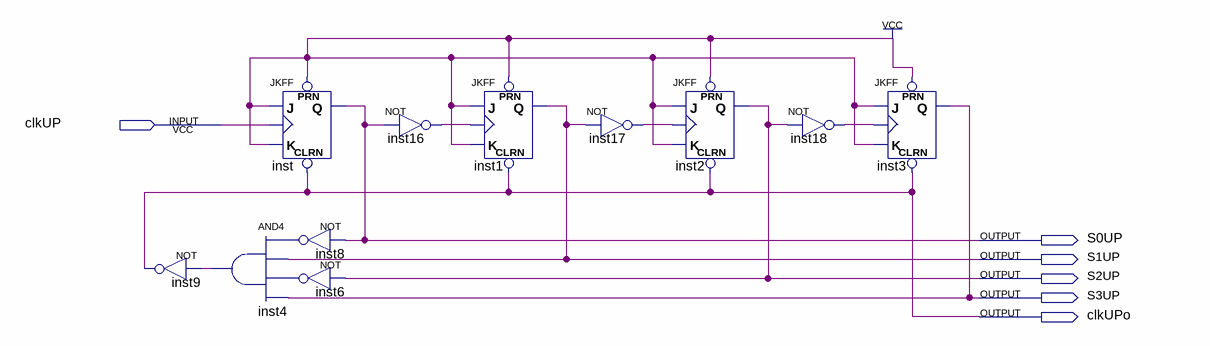
[diagram p0: schematic sheet]
// Quartus schematic contUP.bdf as structural Verilog: 11 symbols, 6 pins
module contUP (
  input  clkUP,
  output S0UP,
  output S1UP,
  output S2UP,
  output S3UP,
  output clkUPo
);

  wire inst4_out, inst6_out, inst8_out, inst16_out, inst17_out, inst18_out;

  not inst9 (clkUPo, inst4_out);
  JKFF inst (.PRN(1'b1), .CLRN(clkUPo), .K(1'b1), .J(1'b1), .CLK(clkUP), .Q(S0UP));
  and inst4 (inst4_out, inst8_out, S1UP, inst6_out, S3UP);
  not inst8 (inst8_out, S0UP);
  not inst6 (inst6_out, S2UP);
  not inst16 (inst16_out, S0UP);
  JKFF inst1 (.PRN(1'b1), .CLRN(clkUPo), .K(1'b1), .J(1'b1), .CLK(inst16_out), .Q(S1UP));
  not inst17 (inst17_out, S1UP);
  JKFF inst2 (.PRN(1'b1), .CLRN(clkUPo), .K(1'b1), .J(1'b1), .CLK(inst17_out), .Q(S2UP));
  not inst18 (inst18_out, S2UP);
  JKFF inst3 (.PRN(1'b1), .CLRN(clkUPo), .K(1'b1), .J(1'b1), .CLK(inst18_out), .Q(S3UP));
endmodule
